# EAGLE design CryptoBoard (EAGLE 7.6.0)
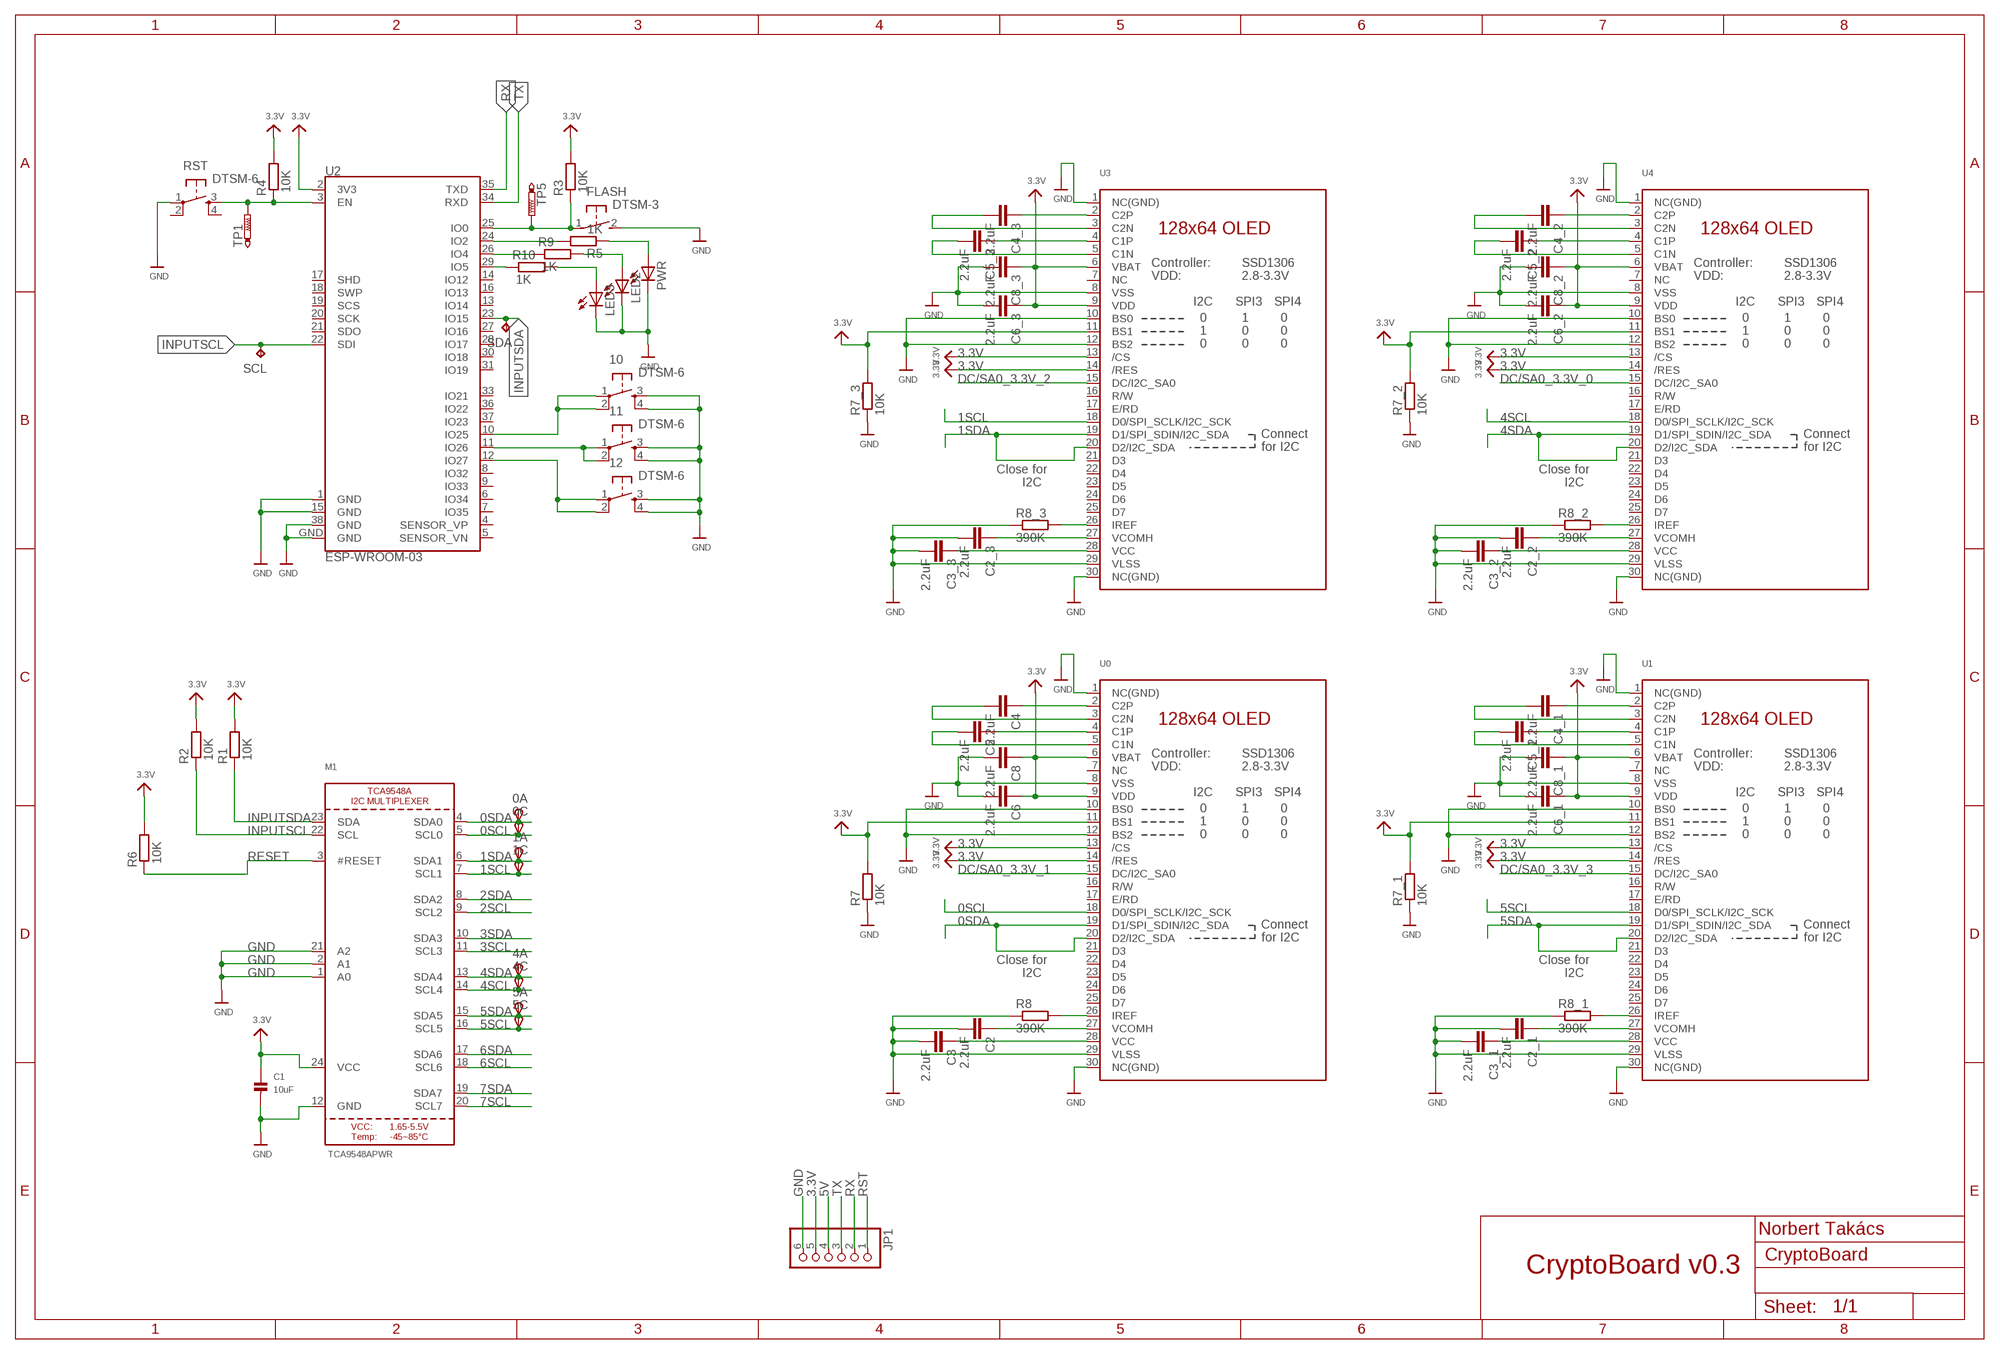
[diagram p0: schematic, sheet 1]

## Parts
0A  TPSTP20R  [TP20R]
0C  TPSTP20R  [TP20R]
1A  TPSTP20R  [TP20R]
1C  TPSTP20R  [TP20R]
4A  TPSTP20R  [TP20R]
4C  TPSTP20R  [TP20R]
5A  TPSTP20R  [TP20R]
5C  TPSTP20R  [TP20R]
10  DTSM-6  [DTSM-6]
11  DTSM-6  [DTSM-6]
12  DTSM-6  [DTSM-6]
C1  10uF  CAP_CERAMIC0805  [0805]
C2  2.2uF  C-EUC0805  [C0805]
C2_1  2.2uF  C-EUC0805  [C0805]
C2_2  2.2uF  C-EUC0805  [C0805]
C2_3  2.2uF  C-EUC0805  [C0805]
C3  2.2uF  C-EUC0805  [C0805]
C3_1  2.2uF  C-EUC0805  [C0805]
C3_2  2.2uF  C-EUC0805  [C0805]
C3_3  2.2uF  C-EUC0805  [C0805]
C4  2.2uF  C-EUC0805  [C0805]
C4_1  2.2uF  C-EUC0805  [C0805]
C4_2  2.2uF  C-EUC0805  [C0805]
C4_3  2.2uF  C-EUC0805  [C0805]
C5  2.2uF  C-EUC0805  [C0805]
C5_1  2.2uF  C-EUC0805  [C0805]
C5_2  2.2uF  C-EUC0805  [C0805]
C5_3  2.2uF  C-EUC0805  [C0805]
C6  2.2uF  C-EUC0805  [C0805]
C6_1  2.2uF  C-EUC0805  [C0805]
C6_2  2.2uF  C-EUC0805  [C0805]
C6_3  2.2uF  C-EUC0805  [C0805]
C8  2.2uF  C-EUC0805  [C0805]
C8_1  2.2uF  C-EUC0805  [C0805]
C8_2  2.2uF  C-EUC0805  [C0805]
C8_3  2.2uF  C-EUC0805  [C0805]
FLASH  DTSM-3  [DTSM-3]
JP1  PINHD-1X6  [1X06]
LED2  LEDSML0805  [SML0805]
LED3  LEDSML0805  [SML0805]
M1  TCA9548APWR  TCA9548A  [TSSOP24]
PWR  LEDSML0805  [SML0805]
R1  10K  R-EU_M0805  [M0805]
R2  10K  R-EU_M0805  [M0805]
R3  10K  R-EU_M0805  [M0805]
R4  10K  R-EU_M0805  [M0805]
R5  1K  R-EU_M0805  [M0805]
R6  10K  R-EU_M0805  [M0805]
R7  10K  R-EU_M0805  [M0805]
R7_1  10K  R-EU_M0805  [M0805]
R7_2  10K  R-EU_M0805  [M0805]
R7_3  10K  R-EU_M0805  [M0805]
R8  390K  R-EU_M0805  [M0805]
R8_1  390K  R-EU_M0805  [M0805]
R8_2  390K  R-EU_M0805  [M0805]
R8_3  390K  R-EU_M0805  [M0805]
R9  1K  R-EU_M0805  [M0805]
R10  1K  R-EU_M0805  [M0805]
RST  DTSM-6  [DTSM-6]
SCL  TPPAD1-13  [P1-13]
SDA  TPPAD1-13  [P1-13]
TP1  PTR1B2,54  [B2,54]
TP5  PTR1B2,54  [B2,54]
U0  DISP_OLED_UG-2864HSWEG01  [UG-2864HSWEG01_1.3_WRAPAROUND]
U1  DISP_OLED_UG-2864HSWEG01  [UG-2864HSWEG01_1.3_WRAPAROUND]
U2  ESP-WROOM-03  [ESP-WROOM-03]
U3  DISP_OLED_UG-2864HSWEG01  [UG-2864HSWEG01_1.3_WRAPAROUND]
U4  DISP_OLED_UG-2864HSWEG01  [UG-2864HSWEG01_1.3_WRAPAROUND]

## Nets
0SCL: 0C.TP(PP) M1.5(SCL0) U0.18(D0/SPI_SCLK/I2C_SCK)
0SDA: 0A.TP(PP) M1.4(SDA0) U0.19(D1/SPI_SDIN/I2C_SDA) U0.20(D2/I2C_SDA)
1SCL: 1C.TP(PP) M1.7(SCL1) U3.18(D0/SPI_SCLK/I2C_SCK)
1SDA: 1A.TP(PP) M1.6(SDA1) U3.19(D1/SPI_SDIN/I2C_SDA) U3.20(D2/I2C_SDA)
2SCL: M1.9(SCL2)
2SDA: M1.8(SDA2)
3.3V [3.3V]: C1.1 C6.1 C6_1.1 C6_2.1 C6_3.1 C8.1 C8_1.1 C8_2.1 C8_3.1 JP1.5 M1.24(VCC) R1.2 R2.2 R3.2 R4.2 R6.2 R7.2 R7_1.2 R7_2.2 R7_3.2 U0.6(VBAT) U0.9(VDD) U0.11(BS1) U0.13(/CS) U0.14(/RES) U1.6(VBAT) U1.9(VDD) U1.11(BS1) U1.13(/CS) U1.14(/RES) U2.2(3V3) U3.6(VBAT) U3.9(VDD) U3.11(BS1) U3.13(/CS) U3.14(/RES) U4.6(VBAT) U4.9(VDD) U4.11(BS1) U4.13(/CS) U4.14(/RES)
3SCL: M1.11(SCL3)
3SDA: M1.10(SDA3)
4SCL: 4C.TP(PP) M1.14(SCL4) U4.18(D0/SPI_SCLK/I2C_SCK)
4SDA: 4A.TP(PP) M1.13(SDA4) U4.19(D1/SPI_SDIN/I2C_SDA) U4.20(D2/I2C_SDA)
5SCL: 5C.TP(PP) M1.16(SCL5) U1.18(D0/SPI_SCLK/I2C_SCK)
5SDA: 5A.TP(PP) M1.15(SDA5) U1.19(D1/SPI_SDIN/I2C_SDA) U1.20(D2/I2C_SDA)
5V: JP1.4
6SCL: M1.18(SCL6)
6SDA: M1.17(SDA6)
7SCL: M1.20(SCL7)
7SDA: M1.19(SDA7)
DC/SA0_3.3V_0: U4.15(DC/I2C_SA0)
DC/SA0_3.3V_1: U0.15(DC/I2C_SA0)
DC/SA0_3.3V_2: U3.15(DC/I2C_SA0)
DC/SA0_3.3V_3: U1.15(DC/I2C_SA0)
GND [ground]: 10.3 10.4 11.3 11.4 12.3 12.4 C1.2 C2.2 C2_1.2 C2_2.2 C2_3.2 C3.2 C3_1.2 C3_2.2 C3_3.2 C6.2 C6_1.2 C6_2.2 C6_3.2 C8.2 C8_1.2 C8_2.2 C8_3.2 FLASH.2 JP1.6 LED2.C LED3.C M1.1(A0) M1.2(A1) M1.12(GND) M1.21(A2) PWR.C R7.1 R7_1.1 R7_2.1 R7_3.1 R8.1 R8_1.1 R8_2.1 R8_3.1 RST.1 U0.1(NC(GND)) U0.8(VSS) U0.10(BS0) U0.12(BS2) U0.29(VLSS) U0.30(NC(GND)) U1.1(NC(GND)) U1.8(VSS) U1.10(BS0) U1.12(BS2) U1.29(VLSS) U1.30(NC(GND)) U2.1(GND) U2.15(GND) U2.38(GND) U2.GND U3.1(NC(GND)) U3.8(VSS) U3.10(BS0) U3.12(BS2) U3.29(VLSS) U3.30(NC(GND)) U4.1(NC(GND)) U4.8(VSS) U4.10(BS0) U4.12(BS2) U4.29(VLSS) U4.30(NC(GND))
INPUTSCL: M1.22(SCL) R2.1 SCL.TP U2.22(SDI)
INPUTSDA: M1.23(SDA) R1.1 SDA.TP U2.23(IO15)
N$4: 10.1 10.2 U2.10(IO25)
N$5: R8.2 U0.26(IREF)
N$6: C4.1 U0.2(C2P)
N$7: C4.2 U0.3(C2N)
N$8: C5.1 U0.4(C1P)
N$9: C5.2 U0.5(C1N)
N$10: R8_3.2 U3.26(IREF)
N$11: C3.1 U0.28(VCC)
N$12: C2.1 U0.27(VCOMH)
N$13: C4_3.1 U3.2(C2P)
N$14: C4_3.2 U3.3(C2N)
N$15: C5_3.1 U3.4(C1P)
N$16: C5_3.2 U3.5(C1N)
N$17: C3_3.1 U3.28(VCC)
N$18: C2_3.1 U3.27(VCOMH)
N$19: R8_1.2 U1.26(IREF)
N$20: C4_1.1 U1.2(C2P)
N$21: C4_1.2 U1.3(C2N)
N$22: C5_1.1 U1.4(C1P)
N$23: C5_1.2 U1.5(C1N)
N$24: R8_2.2 U4.26(IREF)
N$25: C4_2.1 U4.2(C2P)
N$26: C4_2.2 U4.3(C2N)
N$27: C5_2.1 U4.4(C1P)
N$28: C5_2.2 U4.5(C1N)
N$29: C3_2.1 U4.28(VCC)
N$30: C2_2.1 U4.27(VCOMH)
N$31: C3_1.1 U1.28(VCC)
N$32: C2_1.1 U1.27(VCOMH)
N$33: PWR.A R5.1
N$35: R9.1 U2.26(IO4)
N$36: FLASH.1 R3.1 TP5.TP U2.25(IO0)
N$37: R5.2 U2.24(IO2)
N$38: 11.1 11.2 U2.11(IO26)
N$39: 12.1 12.2 U2.12(IO27)
N$44: LED2.A R9.2
N$45: LED3.A R10.2
N$46: R10.1 U2.29(IO5)
RESET: M1.3(#RESET) R6.1
RST: JP1.1
RX: JP1.2 U2.35(TXD)
SHORT: R4.1 RST.3 TP1.TP U2.3(EN)
TX: JP1.3 U2.34(RXD)
Unconnected: RST.2 RST.4 U0.7(NC) U0.16(R/W) U0.17(E/RD) U0.21(D3) U0.22(D4) U0.23(D5) U0.24(D6) U0.25(D7) U1.7(NC) U1.16(R/W) U1.17(E/RD) U1.21(D3) U1.22(D4) U1.23(D5) U1.24(D6) U1.25(D7) U2.4(SENSOR_VP) U2.5(SENSOR_VN) U2.6(IO34) U2.7(IO35) U2.8(IO32) U2.9(IO33) U2.13(IO14) U2.14(IO12) U2.16(IO13) U2.17(SHD) U2.18(SWP) U2.19(SCS) U2.20(SCK) U2.21(SDO) U2.27(IO16) U2.28(IO17) U2.30(IO18) U2.31(IO19) U2.33(IO21) U2.36(IO22) U2.37(IO23) U3.7(NC) U3.16(R/W) U3.17(E/RD) U3.21(D3) U3.22(D4) U3.23(D5) U3.24(D6) U3.25(D7) U4.7(NC) U4.16(R/W) U4.17(E/RD) U4.21(D3) U4.22(D4) U4.23(D5) U4.24(D6) U4.25(D7)

## Notes on the sheet
- Close for | Close for
- I2C | I2C
- Close for | Close for
- I2C | I2C
- Norbert Takács
- CryptoBoard v0.3

## Library data of the parts
0A 0C 1A 1C 4A 4C 5A 5C = testpad:TPS: TEST PIN
10-12 RST = switch-tact:DTSM-6
C1 = microbuilder:CAP_CERAMIC: Ceramic Capacitors 0402 - 0402 Surface Mount Capacitors 16pF 50V 5% [Digikey: 445-4899-2-ND] 18pF 50V 5% [Digikey: 490-1281-2-ND] 22pF 50V 5% [Digikey: 490-1283-2-ND] 68pF 50V 5% [Digikey: 490-1289-2-ND] 0.1uF 10V 10% [Digikey: 490-1318-2-ND] 1.0uF 6.3V 10% [Digikey: 490-1320-2-ND] 0603 - 0603 Surface Mount Capacitors 16 pF 50V 5% [Digikey: 445-5051-2-ND] 22 pF 50V [Digikey: PCC220ACVTR-ND] 33 pF 50V 5% [Digikey: 490-1415-1-ND] 56pF 50V 5% [Digikey: 490-1421-1-ND] 220pF 50V 5% [Digikey: 445-1285-1-ND] 680 pF 50V 2200 pF 50V 5% C0G [Digikey: 445-1297-1-ND] 5600 pF 100V 5% X7R [Digikey: 478-3711-1-ND] 0.1 µF 25V 10% [Digikey: PCC2277TR-ND] 0.22 µF 16V 10% X7R [Digikey: 445-1318-1-ND] 1.0 µF 25V 10% [Digikey: 445-5146-2-ND] 0603 - RF Specific 3pF 250V +/-0.1pF RF [Digikey: 712-1347-1-ND] 18 pF 250V 5% [Digikey: 478-3505-1-ND or 712-1322-1-ND] 56 pF 250V 5% C0G RF [Digikey: 490-4867-1-ND] 68 pF 250V RF [Digikey: 490-4868-1-ND] 0805 - 0805 Surface Mount Capacitors 220 pF 250V 2% RF Ceramic Capacitor [Digikey: 712-1398-1-ND] 1000 pF 50V 2% NP0 Ceramic Capacitor [Digikey: 478-3760-1-ND] 0.1 µF 25V 10% Ceramic Capacitor [Digikey: PCC1828TR-ND] 1.0 µF 16V 10% Ceramic Capacitor[Digikey: 490-1691-2-ND] 10.0 µF 10V 10% Ceramic Capacitor[Digikey: 709-1228-1-ND] 10.0 uF 16V 10% Ceramic Capacitor [Digikey: 478-5165-2-ND] 47 uF 6.3V 20% Ceramic Capacitor [Digikey: 587-1779-1-ND or 399-5506-1-ND] 1206 - 1206 Surface Mount Capacitors 47uF 10V 20% Ceramic Capacitor [Digikey: 490-5528-1-ND or 399-5508-1-ND or 445-6010-1-ND] 100uF 6.3V -20%, +80% Y5V Ceramic Capacitor (Digikey: 490-4512-1-ND, Mouser: 81-GRM31CF50J107ZE1L)
C2 C2_1-C2_3 C3 C3_1-C3_3 C4 C4_1-C4_3 C5 C5_1-C5_3 C6 C6_1-C6_3 C8 C8_1-C8_3 = rcl:C-EU: CAPACITOR, European symbol
FLASH = switch-tact:DTSM-3
JP1 = pinhead:PINHD-1X6: PIN HEADER
LED2 LED3 PWR = led:LED: LED OSRAM: - CHIPLED LG R971, LG N971, LY N971, LG Q971, LY Q971, LO R971, LY R971 LH N974, LH R974 LS Q976, LO Q976, LY Q976 LO Q996 - Hyper CHIPLED LW Q18S LB Q993, LB Q99A, LB R99A - SideLED LS A670, LO A670, LY A670, LG A670, LP A670 LB A673, LV A673, LT A673, LW A673 LH A674 LY A675 LS A676, LA A676, LO A676, LY A676, LW A676 LS A679, LY A679, LG A679 - Hyper Micro SIDELED® LS Y876, LA Y876, LO Y876, LY Y876 LT Y87S - SmartLED LW L88C, LW L88S LB L89C, LB L89S, LG L890 LS L89K, LO L89K, LY L89K LS L896, LA L896, LO L896, LY L896 - TOPLED LS T670, LO T670, LY T670, LG T670, LP T670 LSG T670, LSP T670, LSY T670, LOP T670, LYG T670 LG T671, LOG T671, LSG T671 LB T673, LV T673, LT T673, LW T673 LH T674 LS T676, LA T676, LO T676, LY T676, LB T676, LH T676, LSB T676, LW T676 LB T67C, LV T67C, LT T67C, LS T67K, LO T67K, LY T67K, LW E67C LS E67B, LA E67B, LO E67B, LY E67B, LB E67C, LV E67C, LT E67C LW T67C LS T679, LY T679, LG T679 LS T770, LO T770, LY T770, LG T770, LP T770 LB T773, LV T773, LT T773, LW T773 LH T774 LS E675, LA E675, LY E675, LS T675 LS T776, LA T776, LO T776, LY T776, LB T776 LHGB T686 LT T68C, LB T68C - Hyper Mini TOPLED® LB M676 - Mini TOPLED Santana® LG M470 LS M47K, LO M47K, LY M47K Source: http://www.osram.convergy.de LUXEON: - LUMILED® LXK2-PW12-R00, LXK2-PW12-S00, LXK2-PW14-U00, LXK2-PW14-V00 LXK2-PM12-R00, LXK2-PM12-S00, LXK2-PM14-U00 LXK2-PE12-Q00, LXK2-PE12-R00, LXK2-PE12-S00, LXK2-PE14-T00, LXK2-PE14-U00 LXK2-PB12-K00, LXK2-PB12-L00, LXK2-PB12-M00, LXK2-PB14-N00, LXK2-PB14-P00, LXK2-PB14-Q00 LXK2-PR12-L00, LXK2-PR12-M00, LXK2-PR14-Q00, LXK2-PR14-R00 LXK2-PD12-Q00, LXK2-PD12-R00, LXK2-PD12-S00 LXK2-PH12-R00, LXK2-PH12-S00 LXK2-PL12-P00, LXK2-PL12-Q00, LXK2-PL12-R00 Source: www.luxeon.com KINGBRIGHT: KA-3528ASYC Source: www.kingbright.com
M1 = microbuilder:TCA9548A: TCA9548A I2C Multiplexer
R1-R7 R7_1-R7_3 R8 R8_1-R8_3 R9 R10 = resistor:R-EU_: RESISTOR, European symbol
SCL SDA = testpad:TP: Test pad
TP1 TP5 = testpad:PTR1: TEST PIN
U0 U1 U3 U4 = microbuilder:DISP_OLED_UG-2864HSWEG01: UG-2864HSWEG01 OLED display Both 1.3" and 0.96" models share the same FPC tab footprint, only the screen dimensions vary.
U2 = esp32:ESP-WROOM-03

## Net classes
0 default: width 0.356 mm
1 power: width 0.254 mm
2 3.3V: width 0.762 mm
3 ground: width 0.508 mm

## Board
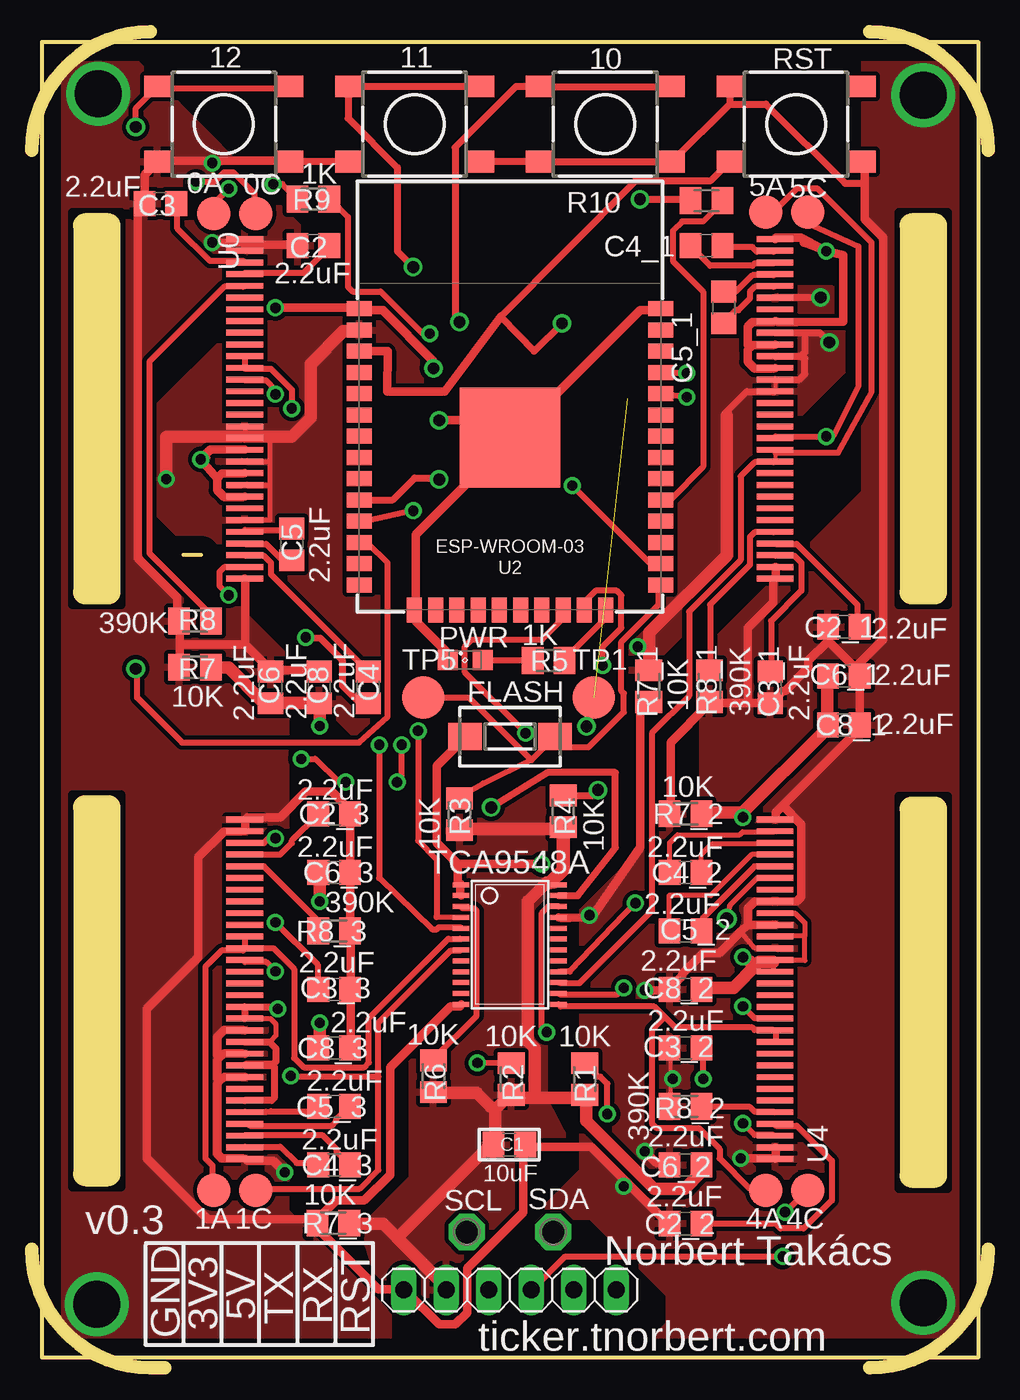
[diagram p1: board, top side]
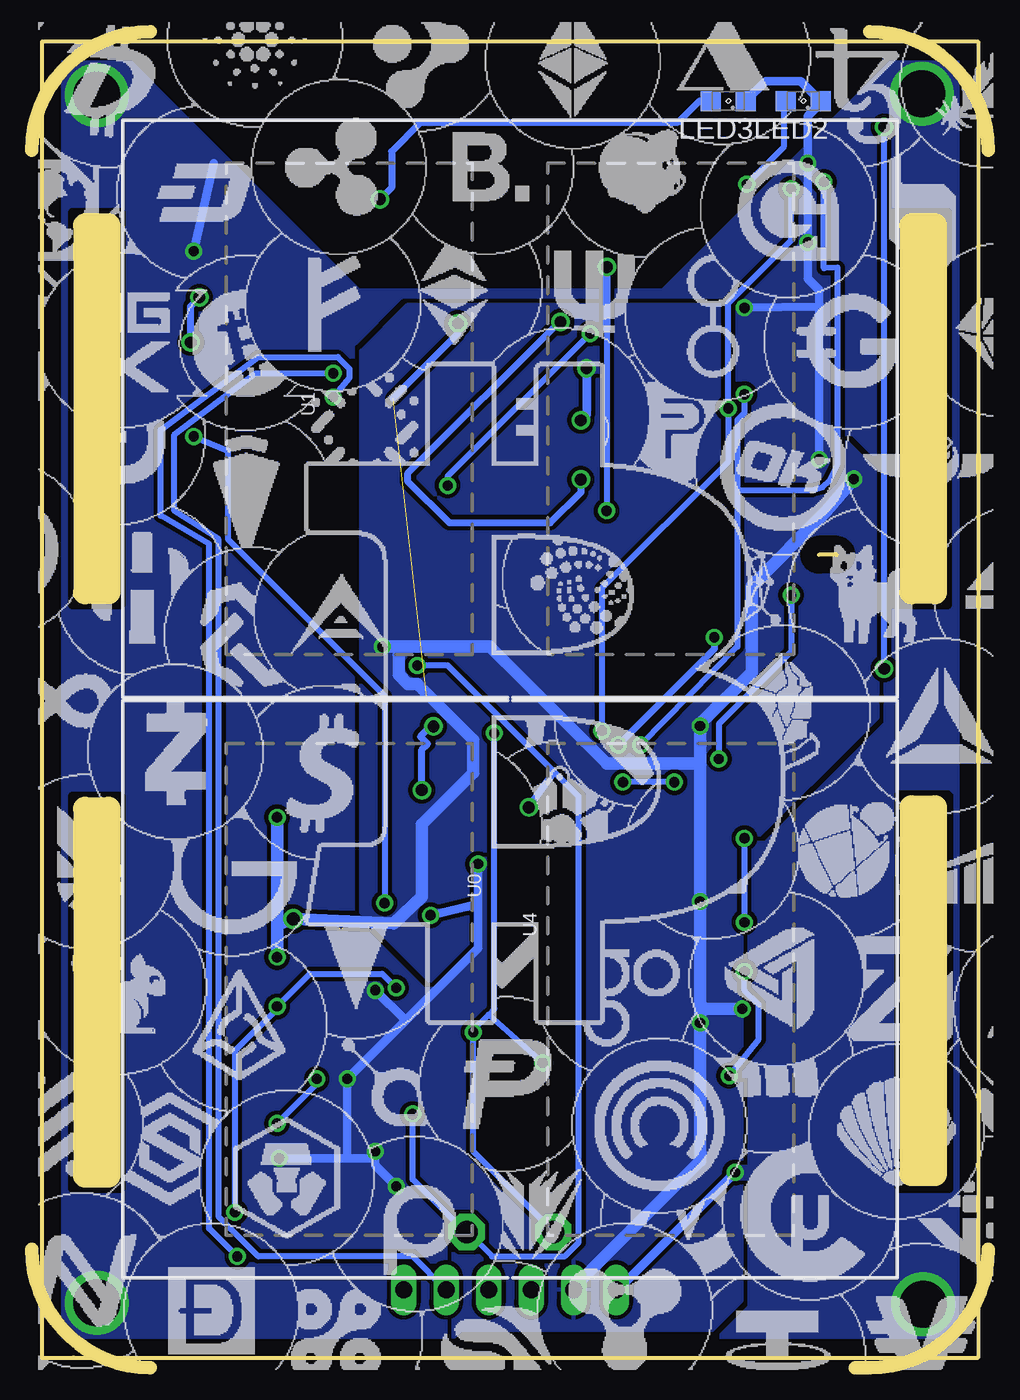
[diagram p2: board, bottom side, seen from below]

Size 55.96 x 78.67 mm. Coordinates in mm from the lower left corner, seen from the top.
Outline: 54.06,0 55.96,0 55.96,78.67 0,78.67 0,0 54.06,0
Outline: 54.06,0 54.06,0
Outline: 8.46,48.02 9.5,48.02
Copper layers (1*16): Top 0.035mm / dielectric 1.5mm / Bottom 0.035mm
Design rules "default *": minimum track width 1mil, minimum drill 24mil, track to track 6mil, track to pad 8mil, pad to pad 8mil, via to via 8mil, smd to smd 8mil, copper to edge 40mil, drill to drill 8mil, minimum pad ring 10mil, minimum via ring 8mil, stop-mask expansion 4mil, vias tented up to drill 0mil, thermal gap 10mil
tRestrict: area 1.8,45 to 4.7,68.5; area 51.2,45 to 54.1,68.5; area 51.2,10.1 to 54.1,33.6; area 1.8,10.2 to 4.7,33.7
bRestrict: area 1.8,45 to 4.7,68.5; area 51.2,45 to 54.1,68.5; area 1.7,10.1 to 4.7,33.6; area 1.8,10.2 to 4.7,33.7; area 51.2,10.1 to 54.1,33.6
Milling: 21 lines

### Footprints (pad centres in the part's own frame; a part is rotated, then mirrored left to right if it is on the bottom)
TP20R = smd 2 x 2: TP 0,0
DTSM-6 = smd 1.55 x 1.3: 1 -3.975,2.25; 2 3.975,2.25; 3 -3.975,-2.25; 4 3.975,-2.25
0805 = smd 1.3 x 1.5: 1 -0.95,0; 2 0.95,0
C0805 = smd 1.3 x 1.5: 1 -0.95,0; 2 0.95,0
DTSM-3 = smd 2 x 1.6: 1 -2.7,0; 2 2.7,0
1X06 = drill 1.016 long: 1 -6.35,0; 2 -3.81,0; 3 -1.27,0; 4 1.27,0; 5 3.81,0; 6 6.35,0
SML0805 = smd 1.2 x 1.2: A 1.05,0; C -1.05,0
TSSOP24 = smd 0.305 x 0.991: 1 -3.575,-2.918; 2 -2.925,-2.918; 3 -2.275,-2.918; 4 -1.625,-2.918; 5 -0.975,-2.918; 6 -0.325,-2.918; 7 0.325,-2.918; 8 0.975,-2.918; 9 1.625,-2.918; 10 2.275,-2.918; 11 2.925,-2.918; 12 3.575,-2.918; 13 3.575,2.918; 14 2.925,2.918; 15 2.275,2.918; 16 1.625,2.918; 17 0.975,2.918; 18 0.325,2.918; 19 -0.325,2.918; 20 -0.975,2.918; 21 -1.625,2.918; 22 -2.275,2.918; 23 -2.925,2.918; 24 -3.575,2.918
M0805 = smd 1.3 x 1.6: 1 -0.95,0; 2 0.95,0
P1-13 = drill 1.321 pad 2.159 octagon: TP 0,0
B2,54 = smd 2.54 x 2.54: TP 0,0
UG-2864HSWEG01_1.3_WRAPAROUND = smd 0.35 x 2.2 bottom: 1 -10.15,-0.2; 2 -9.45,-0.2; 3 -8.75,-0.2; 4 -8.05,-0.2; 5 -7.35,-0.2; 6 -6.65,-0.2; 7 -5.95,-0.2; 8 -5.25,-0.2; 9 -4.55,-0.2; 10 -3.85,-0.2; 11 -3.15,-0.2; 12 -2.45,-0.2; 13 -1.75,-0.2; 14 -1.05,-0.2; 15 -0.35,-0.2; 16 0.35,-0.2; 17 1.05,-0.2; 18 1.75,-0.2; 19 2.45,-0.2; 20 3.15,-0.2; 21 3.85,-0.2; 22 4.55,-0.2; 23 5.25,-0.2; 24 5.95,-0.2; 25 6.65,-0.2; 26 7.35,-0.2; 27 8.05,-0.2; 28 8.75,-0.2; 29 9.45,-0.2; 30 10.15,-0.2
ESP-WROOM-03 = smd 0.9 x 1.5: 1 7.7,9; 2 6.43,9; 3 5.16,9; 4 3.89,9; 5 2.62,9; 6 1.35,9; 7 0.08,9; 8 -1.19,9; 9 -2.46,9; 10 -3.73,9; 11 -5,9; 12 -6.27,9; 13 -7.54,9; 14 -8.81,9; 25 -8.81,-9; 26 -7.54,-9; 27 -6.27,-9; 28 -5,-9; 29 -3.73,-9; 30 -2.46,-9; 31 -1.19,-9; 32 0.08,-9; 33 1.35,-9; 34 2.62,-9; 35 3.89,-9; 36 5.16,-9; 37 6.43,-9; 38 7.7,-9 | smd 1.5 x 0.9: 15 -10.3,5.715; 16 -10.3,4.445; 17 -10.3,3.175; 18 -10.3,1.905; 19 -10.3,0.635; 20 -10.3,-0.635; 21 -10.3,-1.905; 22 -10.3,-3.175; 23 -10.3,-4.445; 24 -10.3,-5.715 | smd 6 x 6: GND 0,0

### Placement (x,y rotation side)
0A  10.28,68.4 0 top
0C  12.78,68.4 0 top
1A  10.28,10.02 180 top
1C  12.78,10.02 180 top
4A  43.27,10.02 180 top
4C  45.77,10.02 180 top
5A  43.27,68.48 0 top
5C  45.77,68.48 0 top
10  33.68,73.75 0 top
11  22.28,73.75 0 top
12  10.88,73.75 0 top
C1  27.94,12.74 0 top
C2  16.24,66.5 180 top
C2_1  47.93,43.7 180 top
C2_2  38.47,8.02 180 top
C2_3  17.47,32.52 0 top
C3  7.08,69 180 top
C3_1  43.53,40.07 270 top
C3_2  38.47,18.52 180 top
C3_3  17.47,22.02 0 top
C4  19.52,40.07 90 top
C4_1  39.73,66.5 180 top
C4_2  38.48,29.01 0 top
C4_3  17.47,11.52 0 top
C5  14.94,48.62 90 top
C5_1  40.76,62.78 270 top
C5_2  38.47,25.52 0 top
C5_3  17.47,15.02 180 top
C6  13.67,40.07 90 top
C6_1  47.93,40.76 0 top
C6_2  38.47,11.52 180 top
C6_3  17.47,29.02 0 top
C8  16.58,40.07 90 top
C8_1  47.93,37.83 0 top
C8_2  38.47,22.02 180 top
C8_3  17.47,18.52 0 top
FLASH  27.98,37.13 180 top
JP1  27.98,4.06 180 top
LED2  10.45,75.13 180 bottom
LED3  14.94,75.13 180 bottom
M1  27.97,24.7 270 top
PWR  25.3,41.71 0 top
R1  32.46,16.66 270 top
R2  28.06,16.66 270 top
R3  24.97,32.48 270 top
R4  31.16,32.66 270 top
R5  30.29,41.68 0 top
R6  23.41,16.83 270 top
R7  9.15,41.28 0 top
R7_1  36.27,40.16 90 top
R7_2  38.47,32.52 0 top
R7_3  17.42,8.04 0 top
R8  9.15,44.04 0 top
R8_1  39.9,40.16 90 top
R8_2  38.47,15.02 0 top
R8_3  17.47,25.52 180 top
R9  16.24,69.26 180 top
R10  39.73,69.17 180 top
RST  45.08,73.75 0 top
SCL  25.39,7.51 0 top
SDA  30.57,7.51 0 top
TP1  32.99,39.47 0 top
TP5  22.8,39.47 0 top
U0  12.33,56.73 90 bottom
U1  43.63,56.73 270 bottom
U2  27.98,55.01 90 top
U3  12.33,22.03 90 bottom
U4  43.63,22.03 270 bottom

### Tracks (layer width: path | path; a pad name or v marks a point on that pad's centre or on a via)
0SCL  (via drill 0.61)
  Top 0.356: v20.17,36.64 20.17,28.68 23.33,25.61 23.6,25.61 23.74,25.75 25,25.75 M1.5 | v13.97,57.6 13.97,57.88 13.41,58.43 12.15,58.43 U0.18 | v9.22,70.31 10.33,70.31 10.89,70.87 11.45,70.87 12.71,69.61 12.71,68.49 0C.TP
  Bottom 0.356: v20.17,36.64 14.38,42.51 14.38,51.87 | 14.38,51.87 14.38,56.06 13.97,56.48 v13.97,57.6 | v9.22,70.31 9.22,65.14 8.41,65.17 8.41,53.44 8.87,52.44 9.3,52.05 9.91,51.87 14.38,51.87
0SDA  (via drill 0.61)
  Top 0.305: M1.4 23.59,26.33 23.58,26.34
  Top 0.356: v22.49,37.48 22.49,30.91 23.6,29.8 23.6,26.44 23.58,26.34 | v14.94,56.76 14.94,57.88 13.69,59.13 12.15,59.13 U0.19 12.15,59.27 12.15,59.83 U0.20 | v11.17,69.89 10.33,69.05 10.33,68.49 0A.TP
  Bottom 0.356: v22.49,37.48 22.49,46 14.94,53.55 v14.94,56.76 14.94,63.04 11.17,66.82 v11.17,69.89
1SCL  (via drill 0.61)
  Top 0.356: 20.11,16.8 20.11,11.22 18.99,10.1 12.85,10.1 1C.TP | 20.11,16.8 20.11,20.02 24.44,24.35 25,24.35 M1.7 | v13.97,23.09 13.41,23.65 12.15,23.65 U3.18 | v14.88,16.85 15.36,16.8 20.11,16.8
  Bottom 0.356: v13.97,23.09 13.97,21.97 13.13,21.14 13.13,19.04 v14.88,16.85
1SDA
  Top 0.356: M1.6 25,25.05 24.3,25.05 19.55,20.3 19.55,17.64 19.27,17.36 15.64,17.36 15.08,17.92 15.08,23.23 13.83,24.49 12.15,24.49 U3.19 | 1A.TP 10.19,10.1 10.19,11.5 9.77,11.91 9.77,23.37 10.75,24.35 12.01,24.35 U3.19 | U3.20 12.15,25.05 12.15,24.63 U3.19
3.3V  (via drill 0.61, 0.7, 0.8)
  Top 0.254: U1.13 U1.14 | 28.73,15.54 R2.2
  Top 0.305: U4.6 42.76,28.68 41.11,27.03 v40.94,26.23 | v40.94,26.23 | U4.9 45.01,26.58 45.6,25.99 45.6,25.22 | 45.6,25.22 43.86,25.22 U4.11 | 45.6,25.22 45.6,23.75 45.57,23.78 U4.13 43.72,23.67 43.72,23.65 43.72,23.18 U4.14 | 12.15,20.3 U3.13 13.66,20.28 13.99,19.95 13.99,19.26 13.65,18.91 12.16,18.91 U3.11 | U0.14 U0.13 | U0.11 13.59,53.58 | 13.59,53.58 13.65,53.63 13.65,55 13.56,55.08 | U0.9 13.63,52.18 13.65,52.16 | 13.65,52.16 13.65,53.53 13.59,53.58 | U0.6 13.64,50.08 13.65,50.09 13.65,52.16 | M1.24 30.77,28.4
  Top 0.406: v14.11,20.86 13.98,20.98 U3.14 U3.13 | 40.93,56.34 40.93,56.56 42.14,57.77 U1.14 | U1.13 45.27,58.48 45.6,58.81 45.6,59.76 45.51,59.85 45.34,59.85 | 45.34,59.85 43.86,59.85 U1.11 | 45.34,59.85 45.6,60.11 45.6,61.23 45.55,61.28 U1.9 46.5,61.28 v47.07,60.71 | v46.55,63.39 U1.6 | U3.11 13.59,18.88 13.99,18.48 13.99,17.7 13.82,17.53 12.18,17.53 U3.9 13.78,17.48 13.9,17.36 13.9,15.54 13.73,15.37 U3.6 | 11.87,55.08 12.02,55.08 U0.13 12.15,55 12.15,55.08 | 30.59,28.4 30.77,28.4
  Top 0.762: R3.2 25,31.61 30.73,31.61 R4.2 | 27.1,14.85 27.1,12.75 C1.1 26.68,12.61 21.23,7.17 | 27.1,14.85 27.94,15.69 R2.2 28.77,15.55 29.47,15.55 | R6.2 23.46,15.83 25.98,15.83 26.82,14.99 27.1,14.85 | C6_2.1 39.39,11.5 39.39,11.08 38.41,10.1 36.6,10.1 32.55,14.15 32.55,15.69 R1.2 32.13,15.55 29.47,15.55 | 30.59,28.4 30.4,28.4 30.17,28.4 29.05,27.28 29.05,18.9 29.47,18.48 29.47,15.55 | 42.67,23.44 42.88,23.65 43.72,23.65 | 42.67,23.44 41.35,22.11 39.53,22.11 C8_2.1 | C6_1.1 46.93,40.69 46.93,37.9 C8_1.1 46.79,37.48 41.91,32.59 | 41.91,32.59 39.53,32.59 R7_2.2 | v41.91,23.95 42.67,23.44 | v41.91,32.31 41.91,32.59 | 36.32,42.51 36.32,43.35 40.93,47.96 40.93,56.34 | 36.32,42.51 36.32,41.11 R7_1.2 | 12.15,55.08 13.56,55.08 14.94,55.08 16.06,56.2 16.06,59.41 18.02,61.37 18.85,61.37 U2.2 | R7.2 10.19,41.25 11.17,41.25 13.27,39.16 C6.1 13.69,39.16 16.48,39.16 C8.1 16.62,38.74 v16.62,37.76 | v16.62,20.02 16.62,18.62 C8_3.1 | v16.62,27.28 16.62,28.96 C6_3.1 | 21.23,7.17 24.3,4.09 JP1.5 | 21.23,7.17 20.39,8 18.44,8 R7_3.2 | 11.87,55.08 10.75,55.08 7.43,55.05 v7.43,52.53 | v35.62,42.51 36.32,42.51
  Top 0.813: R4.2 31.16,29.16 30.4,28.4
  Bottom 0.406: v47.07,60.71 47.07,62.87 v46.55,63.39
  Bottom 0.762: v41.91,32.31 41.91,25.88 | 41.91,25.88 v41.91,23.95 | JP1.5 24.3,4.09 16.62,11.78 v16.62,20.02 16.62,20.86 | 16.62,20.86 v16.62,27.28 16.62,35.52 | 16.62,20.86 v14.11,20.86 | 16.62,35.52 v16.62,37.76 16.48,38.04 13.55,40.97 13.55,46.14 9.08,50.61 v7.43,52.53 | 34.64,42.51 29.19,42.51 22.21,35.52 16.62,35.52 | 34.64,42.51 v35.62,42.51 | 41.91,25.88 v40.94,26.23 34.92,25.97 33.24,27.56 33.24,31.89 30.17,34.97 30.17,36.92 33.52,40.27 34.08,40.27 34.64,40.83 34.64,42.51
  pour Top (isolate 0.254): 27.2,0.09 38.17,0 30.05,15.46 30.05,35.15 43.53,48.62 43.53,54.67 47.84,58.98 47.84,63.3 47.24,63.91 15.72,63.91 14.59,62.78 12.87,62.78 5.27,55.18 5.27,52.16 11.49,45.94 11.49,44.48 22.11,33.85 22.11,10.71 19.17,7.77 21.5,0.17
  pour Bottom (isolate 0.254): 15.89,1.64 30.92,1.64 31.35,1.21 31.35,21.07 36.88,26.6 36.88,60.19 34.11,62.96 13.64,62.96 12.26,64.34 12.26,59.16 6.05,52.94 6.05,38.26 14.16,30.14 14.16,3.37
4SCL  (via drill 0.61)
  Top 0.356: v34.78,22.11 34.36,21.69 31.01,21.69 M1.14 | v41.91,21 42.6,20.3 43.72,20.3 U4.18 | v44.42,8.7 45.68,9.96 4C.TP
  Bottom 0.356: v34.78,22.11 35.62,22.95 39.95,22.95 v41.91,21 41.91,20.86 44.42,18.34 v44.42,8.7
4SDA
  Top 0.356: 37.23,20.37 37.85,19.74 42.46,19.74 42.6,19.6 43.72,19.6 U4.19 43.86,19.46 43.86,18.9 U4.20 | 37.23,20.37 36.6,21 31.01,21 M1.13 | 37.23,20.37 36.46,19.6 36.46,14.01 36.74,13.73 39.25,13.73 40.51,12.47 40.51,11.91 42.32,10.1 43.16,10.1 4A.TP
5SCL  (via drill 0.61)
  Top 0.356: v35.48,27.18 31.57,23.09 31.01,23.09 M1.16 | U1.18 43.86,55.08 v46.89,55.08 47.32,55.14 48.81,58.1 48.81,66.44 45.82,67.79 45.82,68.35 5C.TP
  Bottom 0.356: v35.48,27.18 35.48,39.58 44.84,48.94 44.84,54.24 v46.89,55.08
5SDA
  Top 0.254: U1.19 U1.20
  Top 0.356: M1.15 31.01,22.39 32.13,22.39 36.46,26.72 36.46,37.34 38.69,39.58 38.69,44.6 41.77,47.68 41.77,52.71 42.6,53.55 43.72,53.55 U1.20 | 5A.TP 43.3,68.49 43.72,68.49 45.12,69.89 46.38,69.89 49.59,66.68 49.59,57.74 47.6,54.1 43.86,54.1 U1.19
GND  (via drill 0.61, 0.7, 2.8)
  Top 0.254: 18.47,18.52 C8_3.2 | 18.47,22.14 C3_3.2 | 18.47,25.39 R8_3.1 | C3_2.2 37.6,18.52 37.6,16.66 37.6,15.14 R8_2.1 | U0.29 12.13,66.54 12.13,66.68 U0.30
  Top 0.305: U4.12 42.62,24.48 41.79,25.49 | 9.93,53.8 v9.5,53.71
  Top 0.406: RST.1 41.11,74.95 | 41.11,74.95 10.4 10.3 11.4 | 41.11,74.95 43.28,74.95 48.02,70.21 49.17,70.21 | 11.4 | 11.3 12.4 | 12.4
  Top 0.508: PWR.C 24.16,41.81 24.16,42.23 22.35,44.05 22.35,44.6 U2.15 22.35,44.88 22.35,49.21 27.94,54.8 U2.GND | 27.94,55.08 U2.GND | U2.38 36.88,62.63 35.76,62.63 28.21,55.08 U2.GND | 10.47,52.57 10.47,51.87 10.89,51.45 12.01,51.45 U0.8 | 10.47,52.57 10.75,52.85 12.01,52.85 U0.10 | 12.13,66.54 15.22,66.54 C2.2 | v10.19,66.68 12.13,66.68 | 10.47,52.57 v9.5,53.71 10.07,54.28 U0.12 | 8.24,42.65 8.24,43.91 R8.1 8.1,44.19 8.1,45.44 5.72,47.82 5.72,68.49 6,68.77 C3.2 6.14,69.05 6.14,70.73 6.84,71.43 12.3 7.12,71.57 10.19,71.57 | 8.24,42.65 8.24,41.39 R7.1 | C8.2 16.48,41.11 13.69,41.11 C6.2 13.55,41.25 12.15,42.65 | 12.15,42.65 12.15,46.56 U0.1 | 12.15,42.65 8.24,42.65 | 42.32,60.39 42.46,60.53 43.72,60.53 U1.10 | 42.32,60.39 42.18,60.25 42.18,59.55 42.6,59.13 43.72,59.13 U1.12 | 42.32,60.39 42.18,60.53 42.18,61.65 42.46,61.93 43.72,61.93 U1.8 44,61.93 45.12,61.93 47.9,61.95 47.9,65.93 v46.89,66.16 | U1.1 43.86,66.96 45.4,66.96 v46.89,66.16 | 14.94,71.57 12.4 14.66,71.57 10.19,71.57 | v46.89,66.16 45.54,66.68 | v10.19,71.43 10.19,71.57 | v13.97,62.77 18.85,62.77 U2.1 18.99,62.63 20.39,62.63 20.39,62.6 23.4,59.59 v23.4,59.16 | R8_3.1 18.44,25.61 18.44,28.96 C6_3.2 18.44,29.24 18.44,32.45 C2_3.2 18.44,32.73 17.32,33.85 15.78,33.85 14.24,32.31 12.29,32.31 U3.30 12.15,32.17 12.15,31.61 U3.29 11.87,31.47 10.89,31.47 9.36,29.94 9.36,23.93 6.28,20.86 6.28,11.91 9.91,8.28 16.2,8.28 R7_3.1 | 10.61,16.52 10.89,16.8 12.01,16.8 U3.8 | 10.61,16.52 10.47,16.39 10.47,12.19 10.75,11.91 12.01,11.91 U3.1 12.29,11.78 13.83,11.78 v14.52,11.08 | 10.61,17.92 10.47,17.78 10.47,16.66 10.61,16.52
  Top 0.508: 10.61,17.92 10.89,18.2 12.01,18.2 U3.10 | U3.12 12.01,19.6 10.89,19.6 10.47,19.18 10.47,18.06 10.61,17.92 | M1.12 25,21 24.44,21 20.81,17.36 20.81,10.94 19.27,9.4 17.6,9.4 16.34,8.14 R7_3.1 | R7_3.1 16.34,7.86 20.11,4.09 21.51,4.09 JP1.6 21.79,3.95 23.74,2 24.72,2 25.42,2.69 25.42,5.35 28.77,8.7 28.77,12.47 C1.2 28.91,12.61 32.82,12.61 34.92,10.52 | U1.29 43.86,47.26 43.86,46.7 U1.30 43.72,46.42 43.72,45.16 42.18,43.63 42.18,39.16 | 42.18,39.16 39.95,39.16 R8_1.1 39.81,39.02 37.57,36.78 37.57,32.59 R7_2.1 | 42.18,39.16 43.44,39.16 C3_1.2 43.72,39.3 44.28,39.85 44.42,39.85 45.82,41.25 45.82,41.67 46.93,42.79 47.07,42.79 | 42.18,25.88 41.79,25.49 40.51,24.21 39.53,24.21 38.27,22.95 38.27,22.81 37.57,22.11 C8_2.2 37.3,21.97 v36.04,21.97 | 42.18,25.88 43.72,25.88 U4.10 | 42.18,25.88 42.18,26.86 42.6,27.28 43.72,27.28 U4.8 44,27.28 45.12,27.28 45.4,27.56 45.4,31.89 44.28,33.01 | C6_1.2 48.89,40.69 48.89,37.9 C8_1.2 48.89,37.62 44.28,33.01 | 47.07,42.79 47.07,43.63 C2_1.2 | 47.07,42.79 48.89,40.97 C6_1.2 | 44.28,33.01 43.86,32.59 43.86,32.31 U4.1 | 32.87,26.31 35.76,30.49 35.76,38.74 36.18,39.16 R7_1.1 | 32.87,26.31 31.57,26.3 31.01,26.3 M1.21 | M1.2 25,27.7 25,28.26 M1.1 24.86,28.4 24.86,29.52 | 24.86,29.52 23.6,30.77 23.6,35.38 25.28,37.06 FLASH.2 | U4.29 43.86,12.47 43.86,11.91 U4.30 43.58,11.91 v41.77,11.91 | 34.92,10.52 37.43,8 C2_2.2 | v36.04,12.33 36.74,11.64 37.43,11.64 C6_2.2 | v34.78,10.24 34.78,10.38 34.92,10.52 | v37.71,16.66 37.6,16.66 | v29.89,29.52 24.86,29.52 | v32.73,26.45 32.87,26.31 | 49.17,71.29 49.17,70.21 49.17,68.07 50.29,66.96 50.29,42.93 48.75,41.39 C6_1.2
  Top 0.508: 18.47,25.39 18.47,22.02 | 18.47,18.52 18.47,22.02 | 18.47,22.02 C3_3.2 | v23.75,56.05 26.94,56.05 U2.GND
  Bottom 0.356: 3.35,3.11 v3.28,3.19 | 52.66,3.25 v52.68,3.28
  Bottom 0.508: LED3.C 13.83,75.2 12.71,76.32 10.61,76.32 9.49,75.2 LED2.C 9.49,74.92 10.19,74.22 v10.19,71.43 v10.19,66.68 10.19,64.51 9.5,63.82 9.5,62.85 | 9.5,62.85 v9.5,53.71 | 45.68,71.43 v46.89,66.16 | 9.5,62.85 v13.97,62.77 | v14.52,11.08 21.51,4.09 JP1.6 | v34.78,10.24 36.04,11.5 v36.04,12.33 36.18,11.91 37.71,11.91 | 37.71,11.91 v41.77,11.91 | 37.71,11.91 v37.71,16.66 34.22,20.16 | 29.89,27.14 29.89,24.49 34.22,20.16 | 29.89,27.14 v29.89,29.52 | 29.89,27.14 v32.73,26.45 | 34.22,20.16 v36.04,21.97 | v23.4,59.16 23.4,56.39 v23.75,56.05
  other vias: 3.37,75.57 52.68,75.48
  pour Bottom (isolate 0.254, rank 6): 18.83,63.73 3.97,78.59 0.09,78.59 0.09,0.09 55.96,0.09 55.96,78.67 53.72,78.67 51.99,78.67 37.13,63.82 37.13,63.82 37.05,63.73
  pour Top (isolate 0.254, rank 6): 35.58,0.09 35.67,0 55.96,0 55.96,78.67 49.14,78.67 49.14,51.73 39.47,42.06 39.47,33.85 32.3,26.69 32.3,11.14 29.62,8.46 32.82,8.46 37.48,3.8 37.48,1.99 35.58,0.09
  pour Top (isolate 0.254, rank 6): 20.73,0.17 20.73,2.59 14.59,8.72 14.59,41.88 6.39,50.09 6.39,57.69 14.16,65.46 16.58,65.55 16.75,66.15 4.49,78.59 0.09,78.59 0.09,0 0.17,0.09 20.64,0.09
INPUTSCL  (via drill 0.61)
  Top 0.356: v30.17,19.46 29.89,19.74 29.89,26.58 30.31,27 30.87,27 M1.22 | v28.91,37.34 25.28,40.97 25.28,42.51 25.7,42.93 29.89,42.93 31.15,44.19 31.15,44.6 U2.22 | v26.04,17.62 27.94,17.64 R2.1
  Bottom 0.356: SCL.TP 25.42,7.58 30.17,12.33 v30.17,19.46 30.17,19.6 29.26,20.51 | v28.91,37.34 28.91,20.86 29.26,20.51 | 29.26,20.51 v26.04,17.62
INPUTSDA  (via drill 0.61, 0.7)
  Top 0.356: v33.52,41.39 33.52,42.51 34.64,43.63 34.64,45.58 34.36,45.86 33.1,45.86 32.55,45.3 32.55,44.74 U2.23 | v33.8,14.57 33.8,16.39 33.38,16.8 33.24,16.8 32.55,17.5 R1.1
  Top 0.406: M1.23 32.03,27.63 34.29,30.48 34.29,34.98 30.23,34.98 v26.86,32.9
  Bottom 0.356: v33.52,41.39 31.71,41.39 25.34,35.02 23.88,33.57 23.88,6.89 24.72,6.05 29.05,6.05 30.45,7.44 SDA.TP 30.73,7.58 33.8,10.66 v33.8,14.57
  Bottom 0.406: v26.86,32.9 25.34,35.02
N$4  (via drill 0.7)
  Top 0.406: 10.2 10.1 28.33,76 24.7,72.37 24.7,62.18 v24.96,61.92 | U2.10 20.97,51.28 22.28,52.59 23.66,52.59 v23.75,52.51
  Bottom 0.406: v24.96,61.92 25.04,61.92 34.11,52.85 34.11,52.42 31.61,49.92 25.56,49.92 23.75,51.73 v23.75,52.51
N$5
  Top 0.356: R8.2 10.05,44.05 10.05,44.46 6.42,48.1 6.42,59.55 10.89,64.02 12.01,64.02 U0.26
N$6  (via drill 0.61)
  Top 0.356: 18.99,39.16 19.41,39.16 C4.1 | v21.51,36.64 21.51,34.69 v21.23,34.41 | v18.16,34.41 17.74,34.41 16.34,35.8 v15.5,35.8 | v11.17,45.58 10.61,46.14 10.61,46.98 10.89,47.26 12.01,47.26 U0.2
  Top 0.406: 18.99,39.16 17.98,40.17 17.98,41.61 17.96,41.71 16.67,43.01 v15.77,43.07
  Bottom 0.356: v18.16,34.41 v21.23,34.41 | v15.5,35.8 15.5,37.9 11.17,42.23 v11.17,45.58
  Bottom 0.406: v15.77,43.07 15.77,42.38 v21.51,36.64
N$7
  Top 0.356: C4.2 19.41,41.11 13.69,46.84 13.69,47.54 13.27,47.96 12.15,47.96 U0.3
N$8
  Top 0.356: C5.1 14.8,47.68 14.38,47.68 13.41,48.66 12.15,48.66 U0.4
N$9
  Top 0.356: C5.2 14.8,49.49 12.15,49.49 U0.5
N$10
  Top 0.254: 16.72,26.07 16.77,26.02 16.77,25.77 R8_3.2
  Top 0.356: R8_3.2 16.62,26.02 13.27,29.38 12.15,29.38 U3.26
N$11
  Top 0.356: C3.1 8.1,68.91 8.1,67.52 10.05,65.56 12.01,65.56 U0.28
N$12
  Top 0.356: C2.1 17.18,66.4 15.64,64.86 12.15,64.86 U0.27
N$13
  Top 0.356: C4_3.1 16.48,11.64 15.22,11.64 14.24,12.61 12.15,12.61 U3.2
N$14
  Top 0.356: C4_3.2 18.3,11.64 17.6,12.33 17.6,12.47 16.76,13.31 12.15,13.31 U3.3
N$15
  Top 0.356: C5_3.1 18.3,14.99 17.6,14.29 17.6,14.15 17.32,13.87 12.43,13.87 12.29,14.01 12.15,14.01 U3.4
N$16
  Top 0.356: C5_3.2 16.48,14.73 13.69,14.73 13.41,14.71 12.15,14.71 U3.5
N$17  (via drill 0.61)
  Top 0.356: v13.97,26.02 16.48,23.51 16.48,22.11 C3_3.1 | v13.97,31.05 13.55,31.05 13.27,30.77 12.15,30.77 U3.28
  Bottom 0.356: v13.97,31.05 v13.97,26.02
N$18
  Top 0.356: C2_3.1 16.48,32.45 14.94,30.91 14.94,30.77 14.24,30.08 12.15,30.08 U3.27
N$19
  Top 0.356: R8_1.2 39.95,41.11 39.95,45.02 42.32,47.4 42.32,49.07 42.6,49.35 43.72,49.35 U1.26
N$20
  Top 0.356: C4_1.1 40.79,66.4 42.46,66.4 42.74,66.12 43.72,66.12 U1.2
N$21
  Top 0.356: C4_1.2 38.83,66.4 39.95,65.28 42.46,65.28 42.6,65.42 43.72,65.42 U1.3
N$22
  Top 0.356: C5_1.1 40.79,63.74 41.49,63.74 42.46,64.72 43.72,64.72 U1.4
N$23
  Top 0.356: C5_1.2 40.79,61.93 41.49,62.63 41.63,62.63 42.32,63.32 42.32,63.74 42.6,64.02 43.72,64.02 U1.5
N$24
  Top 0.356: R8_2.2 39.53,14.99 42.32,14.99 42.6,14.71 43.72,14.71 U4.26
N$25
  Top 0.305: C4_2.1 37.53,30.79 38,31.26 41.71,31.26 41.88,31.43 43.78,31.43 U4.2
N$26
  Top 0.305: C4_2.2 39.43,30.1 40.07,30.74 43.79,30.74 U4.3
N$27
  Top 0.305: U4.4 42.43,30.08 39.99,27.63 37.48,27.63 37.48,25.56 C5_2.1
N$28
  Top 0.356: C5_2.2 39.53,25.61 39.53,26.3 42.6,29.38 43.72,29.38 U4.5
N$29  (via drill 0.61)
  Top 0.356: v39.53,16.66 39.53,18.48 C3_2.1 | v41.91,14.01 42.6,13.31 43.72,13.31 U4.28
  Bottom 0.356: v39.53,16.66 39.53,16.39 v41.91,14.01
N$30
  Top 0.356: C2_2.1 39.53,8 43.86,8 44.14,7.72 45.54,7.72 47.21,9.4 47.21,11.78 45.12,13.87 43.86,13.87 U4.27
N$31
  Top 0.356: C3_1.1 43.58,41.11 43.58,44.05 45.4,45.86 45.4,47.54 44.98,47.96 43.86,47.96 U1.28
N$32
  Top 0.356: C2_1.1 48.75,43.77 48.75,45.02 45.12,48.66 43.86,48.66 U1.27
N$33
  Top 0.356: PWR.A 26.4,41.67 29.33,41.67 R5.1
N$35  (via drill 0.61)
  Top 0.356: v31.71,52.15 36.32,47.54 36.88,47.54 U2.26 | v23.19,61.23 22.77,61.23 20.25,63.74 18.58,63.74 18.3,64.02 18.3,68.21 17.32,69.19 R9.1
  Bottom 0.356: v31.71,52.15 31.71,52.71 v23.19,61.23
N$36
  Top 0.356: U2.25 36.88,46.14 36.88,45.02 34.64,42.79 34.64,39.85 34.78,39.72 34.78,38.6 32.69,36.5 31.29,36.5 30.73,37.06 FLASH.1 30.59,37.06 29.26,35.73 | 29.26,35.73 26.41,34.35 25,33.57 R3.1 | 29.26,35.73 25.56,39.44 22.91,39.44 TP5.TP
N$37
  Top 0.356: U2.24 33.66,44.6 33.66,44.19 31.29,41.81 R5.2
N$38  (via drill 0.61, 0.7)
  Top 0.356: v22.21,50.63 19.55,50.05 18.99,50.05 U2.11
  Top 0.406: 11.2 11.1 18.31,74.1 21.24,71.16 21.24,66.15 v22.19,65.2
  Bottom 0.356: 22.21,61.51 v22.21,50.63
  Bottom 0.406: v22.19,65.2 22.19,61.52 22.21,61.51
N$39  (via drill 0.7)
  Top 0.356: U2.12 18.99,48.66 19.55,48.66 20.67,47.54 20.67,38.32 18.96,36.78 8.38,36.78 5.7,39.47 5.7,41.11 v5.61,41.19 | 6.98,75.9 12.1 | 12.2 14.8,75.9 7.12,75.9 12.1 | v5.61,73.58 5.61,74.71 12.1
  Bottom 0.356: v5.61,41.19 v5.61,73.58
N$44  (via drill 0.61)
  Top 0.356: v13.83,70.17 14.38,70.17 15.22,69.33 R9.2
  Bottom 0.356: v13.83,70.17 11.59,72.4 11.59,75.06 LED2.A
N$45  (via drill 0.7)
  Top 0.406: v35.75,69.26 38.69,69.26 R10.2
  Bottom 0.406: LED3.A 16.67,75.13 17.96,73.84 33.34,73.84 35.06,72.11 35.06,69.95 v35.75,69.26
N$46
  Top 0.356: U2.29 37.02,51.31 37.57,51.31 39.53,53.27 39.53,63.74 37.71,65.56 37.71,67.38 38.27,67.93 39.53,67.93 40.65,69.05 R10.1
RESET
  Top 0.254: 23.48,17.29 R6.1
  Top 0.356: M1.3 25.14,26.86 25.84,26.86 25.98,26.72 25.98,20.44 23.46,17.92 R6.1
RX  (via drill 0.61)
  Top 0.356: v38.55,58.85 37.02,58.85 U2.35
  Bottom 0.356: v38.55,58.85 43.16,58.85 48.04,55.19 48.04,50.62 45.4,48.94 45.4,8.42 43.02,6.05 33.8,6.05 31.85,4.09 JP1.2
SHORT  (via drill 0.7)  (1 unrouted)
  Top 0.406: RST.3 39.99,70.38 35.49,70.38 27.44,62.24 29.43,60.17 v31.09,61.83 | R4.1 32.92,33.61 v33.25,33.94 | TP1.TP 32.99,38.52 32.73,38.26 32.73,38 v32.56,37.74
  Top 0.508: U2.3 20.66,60.17 20.64,57.77 24.09,57.77 27.44,62.24
  Bottom 0.406: v31.09,61.83 31.09,61.23 34.98,57.34 | v33.25,33.94 33.25,36.36 32.9,36.7 33.34,37.13 32.64,37.83 v32.56,37.74
TX  (via drill 0.61)
  Top 0.356: v38.55,57.42 37.02,57.6 U2.34 | v44.28,6.05 31.29,6.05 29.33,4.09 JP1.3
  Bottom 0.356: v38.55,57.42 37.57,58.57 37.57,59.13 38.27,59.83 43.02,59.83 48.85,55.47 48.85,50.34 45.96,48.66 45.96,7.72 v44.28,6.05

### Text on the board
tPlace: TCA9548A | v0.3 | Norbert Takács | 5V | 3V3 | TX | RX | RST | GND | ticker.tnorbert.com
Measures: All dimensions in inches
_tsilk: TCA9548A | C1 | VCC | GND